# EAGLE design Tally_v01 (EAGLE 6.2)
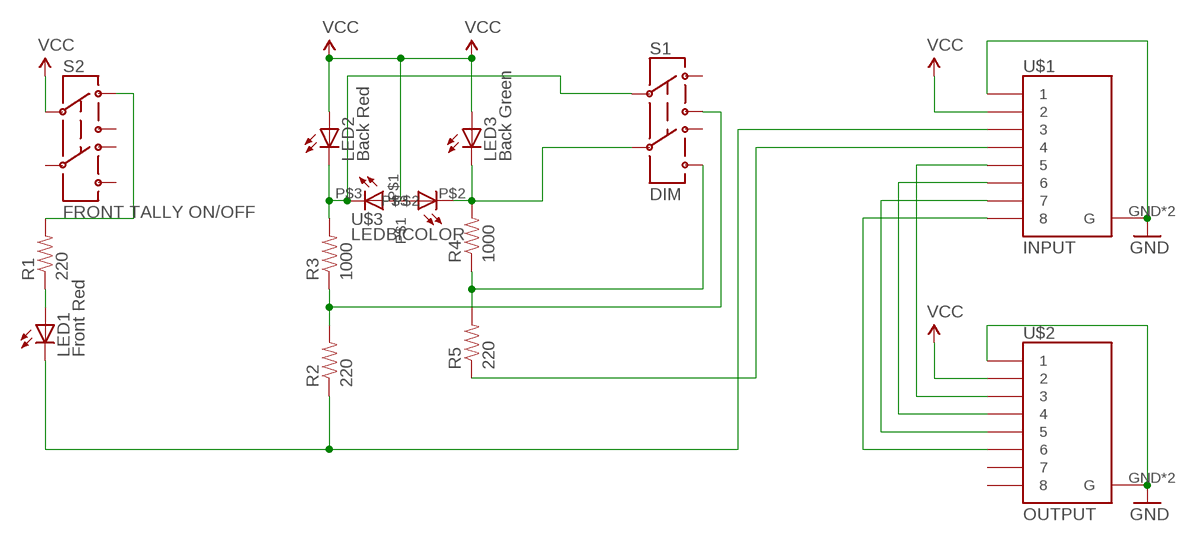
[diagram p0: schematic, sheet 1]

## Parts
LED1  Front Red  LED20  [LED20]
LED2  Back Red  LED20  [LED20]
LED3  Back Green  LED20  [LED20]
R1  220  RESISTORPTH-1/4W  [AXIAL-0.4]
R2  220  RESISTORPTH-1/4W  [AXIAL-0.4]
R3  1000  RESISTORPTH-1/4W  [AXIAL-0.4]
R4  1000  RESISTORPTH-1/4W  [AXIAL-0.4]
R5  220  RESISTORPTH-1/4W  [AXIAL-0.4]
S1  DIM  SWITCH-DPDTPTH1  [TECONNECTIVITY-DPDT]
S2  FRONT TALLY ON/OFF  SWITCH-DPDTPTH1  [TECONNECTIVITY-DPDT]
U$1  INPUT  RJ45-8_GND  [RJ45-8_GND]
U$2  OUTPUT  RJ45-8_GND  [RJ45-8_GND]
U$3  LEDBICOLOR  [LEDBICOLOR]

## Nets
GND [POWER]: U$1.1 U$1.GND1(G) U$1.GND(G) U$2.1 U$2.GND1(G) U$2.GND(G)
N$1: R1.P$2 S2.P$1
N$2: LED1.P$1(A) R1.P$1
N$3: R2.P$2 R3.P$1 S1.P$3
N$4: R4.P$1 R5.P$2 S1.P$6
N$5 [POWER]: LED3.P$2(C) R4.P$2 S1.P$5 U$3.P$2
N$6 [POWER]: LED2.P$2(C) R3.P$2 S1.P$2 U$3.P$3
N$7: U$1.5 U$2.3
N$8: U$1.6 U$2.4
N$9: LED1.P$2(C) R2.P$1 U$1.3
N$10: R5.P$1 U$1.4
N$11: U$1.7 U$2.5
N$12: U$1.8 U$2.6
VCC [POWER]: LED2.P$1(A) LED3.P$1(A) S2.P$2 U$1.2 U$2.2 U$3.P$1
Unconnected: S1.P$1 S1.P$4 S2.P$3 S2.P$4 S2.P$5 S2.P$6 U$2.7 U$2.8

## Library data of the parts
LED1-LED3 = SKAARHOJ:LED20: KINGBRIGHT 20MM BIG LAMP
R1-R5 = SparkFun:RESISTOR: Resistor Basic schematic elements and footprints for 0603, 1206, and PTH resistors.
S1 S2 = SKAARHOJ:SWITCH-DPDT: DPDT Version of the COM-00597
U$1 U$2 = SKAARHOJ:RJ45-8_GND
U$3 = SKAARHOJ:LEDBICOLOR: L.C.LED N810TGLR2D 10mm Diffused Bicolor Led Lamp (Anode)

## Net classes
0 default: width 0.254 mm, drill 0.559 mm, clearance 0.152 mm
1 POWER: width 0.406 mm, drill 0.686 mm, clearance 0.203 mm

## Board
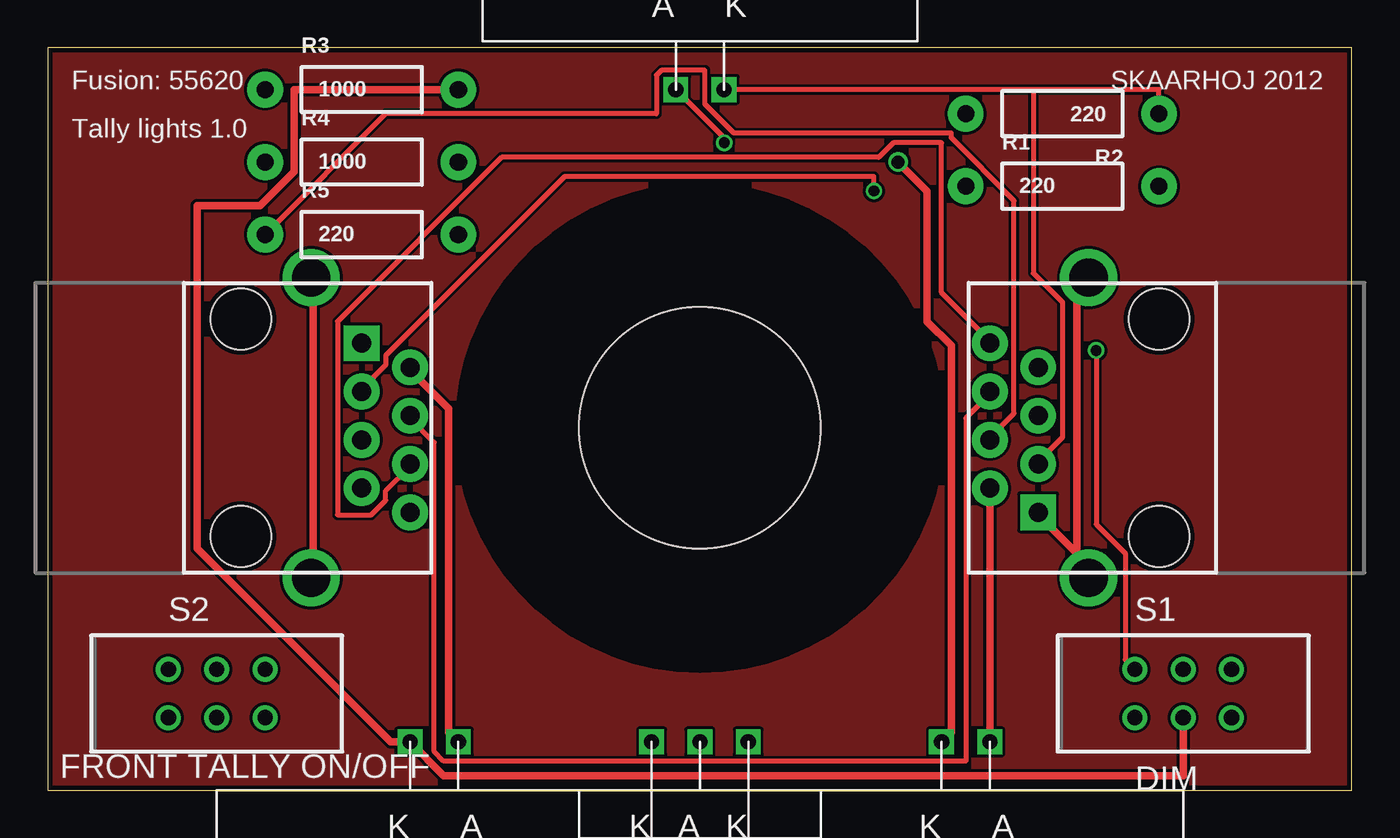
[diagram p1: board, top side]
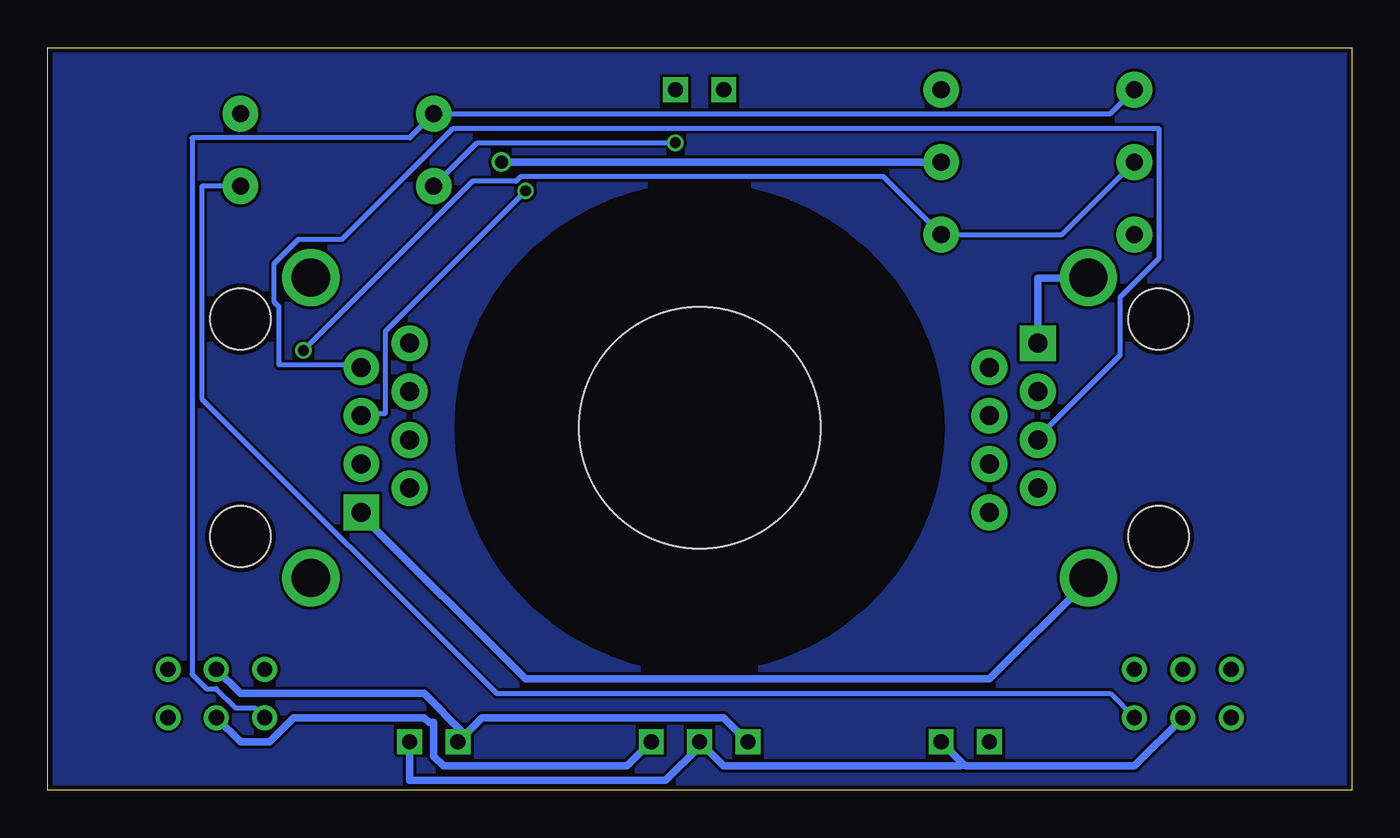
[diagram p2: board, bottom side, seen from below]

Size 68.56 x 39.04 mm. Coordinates in mm from the lower left corner, seen from the top.
Outline: 0,0 68.56,0 68.56,39.04 0,39.04 0,0
Copper layers (1*16): Top 0.035mm / dielectric 1.5mm / Bottom 0.035mm
Design rules: minimum track width 6mil, minimum drill 12mil, track to track 6mil, track to pad 6mil, pad to pad 6mil, via to via 6mil, smd to smd 0mil, copper to edge 10mil, drill to drill 10mil, minimum pad ring 10mil, minimum via ring 6mil, stop-mask expansion 2mil, vias tented up to drill 100mil, thermal gap 10mil
Holes 12.7 mm at 34.29,19.05
tRestrict: area 21.6,6.3 to 47,31.8
bRestrict: area 21.6,6.3 to 47,31.8

### Footprints (pad centres in the part's own frame; a part is rotated, then mirrored left to right if it is on the bottom)
LED20 = drill 0.8 square: P$1 -1.27,-2.54; P$2 1.27,-2.54
AXIAL-0.4 = drill 0.9 pad 1.88: P$1 -5.08,0; P$2 5.08,0
TECONNECTIVITY-DPDT = drill 0.8: P$1 1.27,2.54; P$2 1.27,0; P$3 1.27,-2.54; P$4 -1.27,2.54; P$5 -1.27,0; P$6 -1.27,-2.54
RJ45-8_GND = drill 1 pad 1.88 square: 1 -4.445,6.35 | drill 1 pad 1.88: 2 -3.175,8.89; 3 -1.905,6.35; 4 -0.635,8.89; 5 0.635,6.35; 6 1.905,8.89; 7 3.175,6.35; 8 4.445,8.89 | drill 2: GND -7.9,3.7; GND1 7.9,3.7 | hole 3.2: -5.715,0; 5.715,0
LEDBICOLOR = drill 0.8 square: P$1 0,-2.54; P$2 2.54,-2.54; P$3 -2.54,-2.54

### Placement (x,y rotation side)
LED1  34.29,39.37 0 top
LED2  20.32,0 180 top
LED3  48.26,0 180 top
R1  53.34,31.75 0 top
R2  53.34,35.56 180 top
R3  16.51,36.83 0 top
R4  16.51,33.02 0 top
R5  16.51,29.21 0 top
S1  59.69,5.08 270 top
S2  8.89,5.08 270 top
U$1  58.42,19.05 90 top
U$2  10.16,19.05 270 top
U$3  34.29,0 180 top

### Tracks (layer width: path | path; a pad name or v marks a point on that pad's centre or on a via)
GND
  Top 0.406: U$2.GND1 13.97,11.18 13.97,26.92 U$2.GND | 53.98,12.57 54.61,11.94 54.61,11.18 U$1.GND | 53.98,12.57 52.07,14.48 U$1.1 | U$1.GND1 54.61,26.92 54.1,26.42 54.1,12.7 53.98,12.57
  Bottom 0.406: U$2.1 16.51,26.92 13.97,26.92 U$2.GND | U$2.GND1 13.97,10.92 19.05,5.84 43.43,5.84 52.07,14.48 U$1.1
N$1
  Bottom 0.254: S2.P$1 12.7,5.08 44.96,5.08 60.45,20.57 60.45,31.75 R1.P$2
N$2  (via drill 0.56)
  Top 0.254: LED1.P$1 35.56,34.29 v35.56,34.04
  Bottom 0.254: v35.56,34.04 45.97,34.04 R1.P$1
N$3
  Bottom 0.254: S1.P$3 57.66,4.32 58.67,4.32 59.69,5.33 60.2,5.33 60.96,6.1 60.96,34.29 49.53,34.29 R2.P$2 12.7,35.56 R3.P$1
N$4  (via drill 0.56)
  Top 0.254: S1.P$6 56.64,6.86 56.64,12.45 55.12,13.97 v55.12,23.11
  Bottom 0.254: v55.12,23.11 46.23,32 43.94,32 43.69,32.26 24.64,32.26 R5.P$2 15.24,29.21 R4.P$1
N$5  (via drill 0.69)
  Top 0.406: v44.7,33.02 46.23,31.5 46.23,24.64 47.5,23.37 47.5,3.05 LED3.P$2
  Bottom 0.406: U$3.P$2 33.02,3.81 45.72,3.81 LED3.P$2 46.74,3.05 48.77,5.08 58.42,5.08 S1.P$5 | v44.7,33.02 R4.P$2
N$6
  Top 0.406: S1.P$2 59.69,0.76 20.83,0.76 LED2.P$2 18.03,2.54 7.87,12.7 7.87,30.73 11.18,30.73 12.95,32.51 12.95,36.83 R3.P$2
  Bottom 0.406: U$3.P$3 38.1,1.27 47.75,1.27 48.26,1.78 48.26,3.56 48.51,3.56 48.77,3.81 55.63,3.81 56.9,2.54 58.42,2.54 S1.P$2
N$7  (via drill 0.56)
  Top 0.254: v43.43,31.5 43.43,32.26 27.18,32.26 17.78,22.86 17.78,22.35 16.51,21.08 U$2.3
  Bottom 0.254: v43.43,31.5 50.8,24.13 50.8,19.81 52.07,19.81 U$1.5
N$8
  Top 0.254: U$2.4 19.05,19.56 20.32,18.29 20.32,2.03 20.83,1.52 48.26,1.52 48.26,19.56 49.53,20.83 U$1.6
N$9
  Top 0.254: 51.82,36.83 58.42,36.83 R2.P$1 | 51.82,36.83 LED1.P$2 | 51.82,36.83 51.82,27.18 53.34,25.65 53.34,18.54 52.07,17.27 U$1.3
N$10
  Top 0.254: R5.P$1 17.78,35.56 32,35.56 32,37.59 32.26,37.85 34.54,37.85 34.54,36.07 36.07,34.54 47.5,34.54 47.5,34.29 50.8,30.99 50.8,19.81 49.53,18.54 U$1.4
N$11
  Bottom 0.254: U$2.5 16.51,18.54 12.19,22.86 12.19,25.91 10.16,27.94 10.16,34.8 47.24,34.8 53.09,28.96 55.37,28.96 56.64,27.69 56.64,25.65 56.39,25.4 56.39,22.35 52.07,22.35 U$1.7
N$12
  Top 0.254: U$2.6 19.05,17.02 17.78,15.75 17.78,15.24 17.02,14.48 15.24,14.48 15.24,24.64 23.88,33.27 43.69,33.27 44.45,34.04 46.99,34.04 46.99,26.16 49.53,23.62 U$1.8
N$13
  pour Bottom: 0,39.37 68.58,39.37 68.58,0 0,0
N$14
  pour Top: 0,39.37 0,0 68.58,0 68.58,39.37
VCC
  Top 0.406: U$1.2 LED3.P$1 | LED2.P$1 21.08,3.05 21.08,20.07 19.05,22.1 U$2.2
  Bottom 0.406: S2.P$2 11.43,1.27 20.32,1.27 20.45,1.4 | LED2.P$1 20.45,1.4 | 20.45,1.4 20.57,1.27 33.02,1.27 U$3.P$1 34.29,2.29 36.07,0.51 49.53,0.51 LED3.P$1

### Text on the board
_tsilk: Fusion: 55620 | SKAARHOJ 2012 | Tally lights 1.0